# Altium schematic sheet ADC.SchDoc
size A4
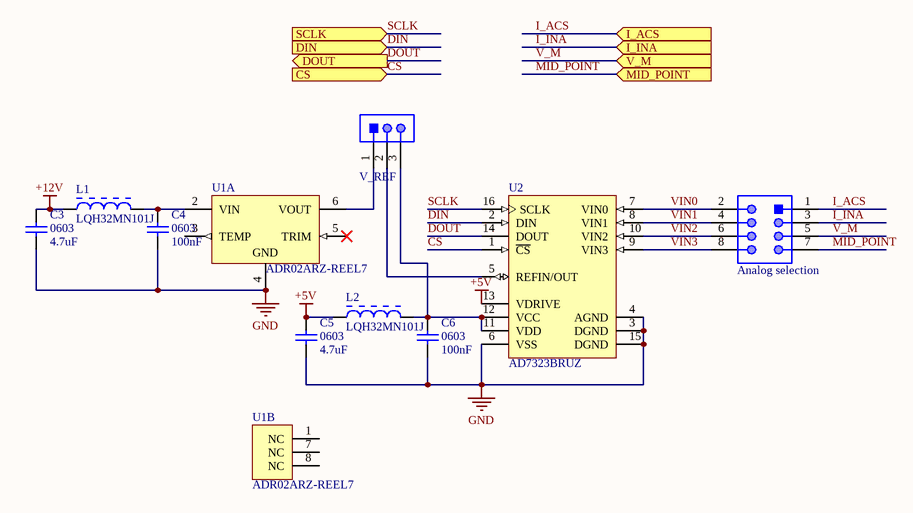
[diagram p0: ADC.SchDoc]

## Parts
Analog_selection  61300821121  [61300821121]  (value not drawn)
C3  value 4.7uF  Case-EIA: 0603  [CAPC0603(1608)55_M]  (hidden comment: CAP 4.7uF 10V 0603(1608))
C4  value 100nF  Case-EIA: 0603  [CAPC0603(1608)100_M]  (hidden comment: CAP 100nF 10V 0603(1608))
C5  value 4.7uF  Case-EIA: 0603  [CAPC0603(1608)55_M]  (hidden comment: CAP 4.7uF 10V 0603(1608))
C6  value 100nF  Case-EIA: 0603  [CAPC0603(1608)100_M]  (hidden comment: CAP 100nF 10V 0603(1608))
L1  Comment_1: LQH32MN101J  [BOUR-SRN3015-2_V]  (hidden comment: CM311411-101KL)
L2  Comment_1: LQH32MN101J  [BOUR-SRN3015-2_V]  (hidden comment: CM311411-101KL)
U1  ADR02ARZ-REEL7  [ADI-R-8_L]  (parts A,B of 2)
U2  AD7323BRUZ  [RU-16_N]
V_REF  61300311121  [61300311121]  (value not drawn)

## Ports
CS (in), DIN (in), DOUT (out), I_ACS (in), I_INA (in), MID_POINT (in), SCLK (in), V_M (in)

## Nets
+5V: C5.2 L2.1 U2.13(VDRIVE)
+12V: C3.2 L1.1
GND: C3.1 C4.1 C5.1 C6.1 U1.4(GND) U2.3(DGND) U2.4(AGND) U2.6(VSS) U2.15(DGND)
CS: U2.1(~{CS}) ; port CS
DIN: U2.2(DIN) ; port DIN
DOUT: U2.14(DOUT) ; port DOUT
I_ACS: Analog_selection.1 ; port I_ACS
I_INA: Analog_selection.3 ; port I_INA
MID_POINT: Analog_selection.7 ; port MID_POINT
SCLK: U2.16(SCLK) ; port SCLK
V_M: Analog_selection.5 ; port V_M
VIN0: Analog_selection.2 U2.7(VIN0)
VIN1: Analog_selection.4 U2.8(VIN1)
VIN2: Analog_selection.6 U2.10(VIN2)
VIN3: Analog_selection.8 U2.9(VIN3)
NetC4_2: C4.2 L1.2 U1.2(VIN)
NetC6_2: C6.2 L2.2 U2.11(VDD) U2.12(VCC) V_REF.3
NetU1_6: U1.6(VOUT) V_REF.1
NetU2_5: U2.5(REFIN/OUT) V_REF.2

Not connected (* = marked no-connect by the designer): U1 1(NC) 3(TEMP) 5(TRIM)* 7(NC) 8(NC)

## Library data of the parts
Analog_selection = CMP-1502-01078-1: THT Vertical Pin Header WR-PHD, Pitch 2.54 mm, Dual Row, 8 pins; Manufacturer: Wurth Elektronik; Contact Resistance: 20mOhm; Rated Current: 3A; Working Voltage: 250VAC; Pin Number: 8; Withstanding Voltage: 500VAC; Pitch: 2.54mm; Gender: Male; Datasheet URL: https://katalog.we-online.de/em/datasheet/6130xx21121.pdf; Package Reference: 61300821121; Orientation: Vertical; Part Number: 61300821121; Publisher: WurthElektronik; Mounting Technology: THT; Manufacturer URL: http://www.we-online.de; Packaging: Bag; Row Number: Dual; Operating Temperature: -40to105degC
C3 C5 = CMP-1035-02786-1: CAP 4.7uF 10V ±20% 0603 (1608 Metric) Thickness 0.55mm SMD; Tolerance: Â±20%; Case-Metric: 1608; Technology: SMT; Max Thickness: 0.55 mm; Rated Voltage: 10 V
C4 C6 = CMP-1035-02581-1: CAP 100nF 10V ±20% 0603 (1608 Metric) Thickness 1mm SMD; Tolerance: Â±20%; Case-Metric: 1608; Max Thickness: 1 mm; Rated Voltage: 10 V; Technology: SMT
L1 L2 = CMP-0007-00009-1: Semi-shielded Power Inductor, 100 uH, +/- 20%, 0.29 A, -40 to 125 degC, 3 x 3 x 1.5 mm SMD, RoHS and Halogen Free, Tape and Reel; Manufacturer: Bourns; PartNumber: SRN3015-101M; Isat: 0.27 A; Rated current: 0.29 A; DCR Max: 2.92 Ohm; Inductance tolerance: +/- 20%; SRF Min: 11 MHz; Resistance to Solder Heat: +260 degC for 10 sec.; Inductance: 100 uH; ComponentLink3Description: Package Specification; Mounting Technology: Surface Mount; RoHS: TRUE; ComponentLink3URL: http://www.bourns.com/data/global/pdfs/SRN3015.pdf; PackageDescription: 2-Pin SMD, Body 3 x 3 mm, Height 1.5 mm; PackageReference: SRN3015; ComponentLink1Description: Manufacturer URL; ComponentLink2URL: http://www.bourns.com/data/global/pdfs/SRN3015.pdf; Operating Temperature: -40 to 125 degC; DatasheetVersion: Aug-11; ComponentLink1URL: http://www.bourns.com/; Packing: Tape and Reel; ComponentLink2Description: Datasheet
U1 = CMP-0784-00325-1: Ultracompact, Precision Voltage Reference, 5 V Output, 7 to 36 V Supply, Industrial, 8-pin SOIC (R-8), Reel; Manufacturer: Analog Devices; Ref Out TC (ppm/C): 3; Automotive Qualified: Yes; Max V Supply (V): 36; Vout: 5V; Min V Supply (V): 7; PackageVersion: 060506-A, 06/2006; ComponentLink1Description: Manufacturer URL; ComponentLink1URL: http://www.analog.com/en/index.html; PartNumber: ADR02ARZ-REEL7; Operating Temp Range: -40 to 125 degC; ComponentLink4Description: URL Link1; ComponentLink2Description: Datasheet; ComponentLink2URL: http://www.analog.com/static/imported-files/data_sheets/ADR01_02_03_06.pdf; ComponentLink3Description: Package Specification; DatasheetVersion: Rev. R; PackageDescription: 8-Pin Standard Small Outline Package, Body 4.9 x 3.9 mm, Pitch 1.27 mm; Code_JEDEC: MS-012-AA; ComponentLink3URL: http://www.analog.com/static/imported-files/packages/PKG_PDF/SOIC_Narrow%20(R)/R_8.pdf; PackageReference: R-8; Mounting Technology: Surface Mount; Packing: Reel; ComponentLink4URL: Product URL:http://www.analog.com/en/special-linear-functions/voltage-references/adr02/products/product.html; PartId: 1
U2 = CMP-0313-01966-2: Quad 13-Bit True Bipolar Input Plus Sign Analog-to-Digital Converter with Serial, SPI Interface, Software-Selectable, 500KSPS, -40 to +85 degC, RU-16, Pb-Free, Tube; Manufacturer: Analog Devices; Generic Part Number: AD7323; Interface: Ser, SPI; Channels: 4; Resolution (Bits): 13; Throughput Rate (SPS): 500K; PackageReference: RU-16; ComponentLink4URL: http://www.analog.com/en/analog-to-digital-converters/ad-converters/ad7323/products/product.html; PartNumber: AD7323BRUZ; ComponentLink3URL: http://www.analog.com/static/imported-files/packages/36244347913743854010197452789RU16.pdf; Packing: Tube; Mounting Technology: Surface Mount; DatasheetVersion: Rev.A; RoHS: Y; PackageVersion: Nov-2002; ComponentLink2Description: Datasheet; ComponentLink1URL: http://www.analog.com/en/index.html; ComponentLink1Description: Manufacturer URL; Code_JEDEC: MO-153-AB; ComponentLink2URL: http://www.analog.com/static/imported-files/data_sheets/AD7323.pdf; ComponentLink4Description: Product URL; PackageDescription: 16-Lead Thin Shrink Small Outline Package [TSSOP]; ComponentLink3Description: Package Specification
V_REF = CMP-1502-01062-1: THT Vertical Pin Header WR-PHD, Pitch 2.54 mm, Single Row, 3 pins; Manufacturer: Wurth Elektronik; Withstanding Voltage: 500VAC; Working Voltage: 250VAC; Rated Current: 3A; Pitch: 2.54mm; Pin Number: 3; Gender: Male; Contact Resistance: 20mOhm; Package Reference: 61300311121; Manufacturer URL: http://www.we-online.de; Datasheet URL: https://katalog.we-online.de/em/datasheet/6130xx11121.pdf; Operating Temperature: -40to105degC; Part Number: 61300311121; Orientation: Vertical; Packaging: Bag; Row Number: Single; Mounting Technology: THT; Publisher: WurthElektronik